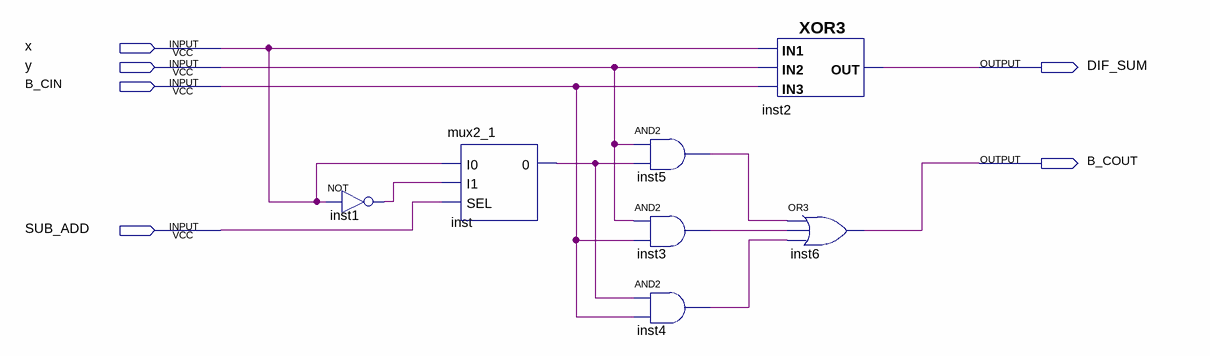
[diagram p0: schematic sheet]
// Quartus schematic fullSubAdd.bdf as structural Verilog: 7 symbols, 6 pins
module fullSubAdd (
  input  x,
  input  y,
  input  B_CIN,
  input  SUB_ADD,
  output DIF_SUM,
  output B_COUT
);

  wire inst1_out, inst3_out, inst4_out, inst5_out, inst_0;

  not inst1 (inst1_out, x);
  mux2_1 inst (.I0(x), .I1(inst1_out), .SEL(SUB_ADD), .\0 (inst_0));
  and inst5 (inst5_out, y, inst_0);
  and inst3 (inst3_out, y, B_CIN);
  and inst4 (inst4_out, inst_0, B_CIN);
  XOR3 inst2 (.IN3(B_CIN), .IN1(x), .IN2(y), .OUT(DIF_SUM));
  or inst6 (B_COUT, inst5_out, inst3_out, inst4_out);
endmodule
